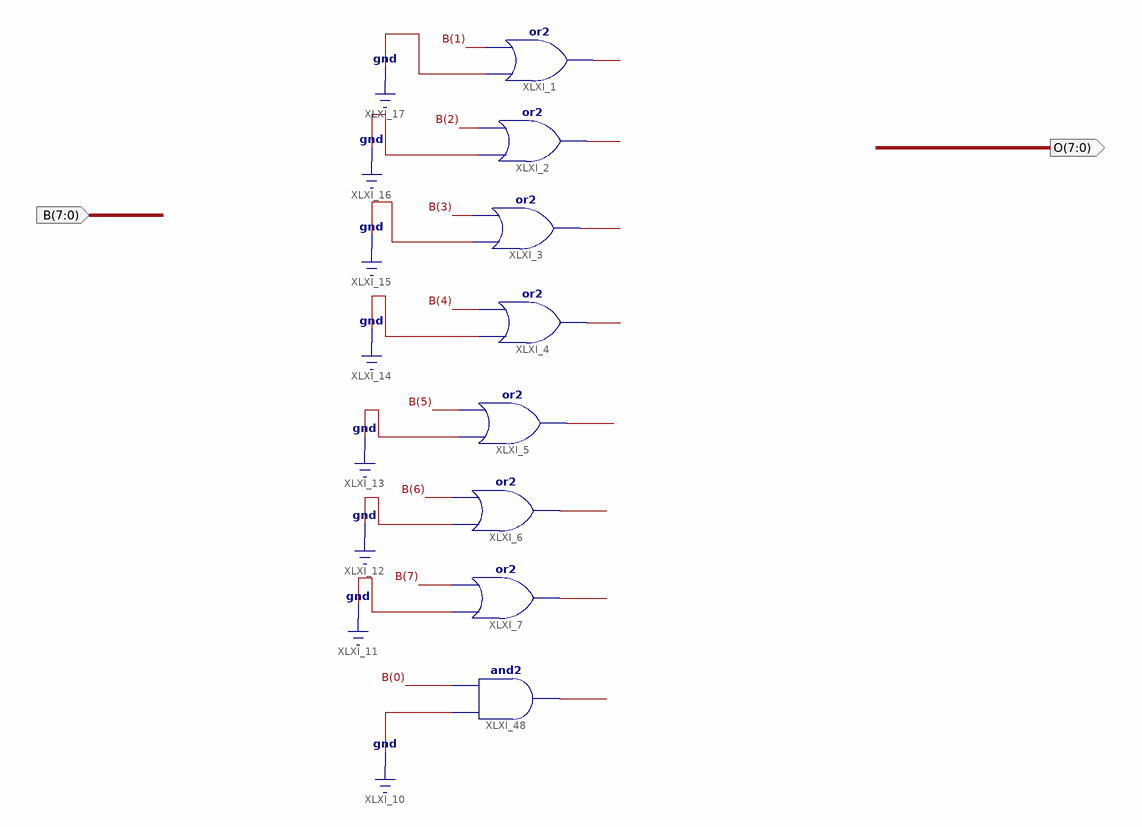
[diagram p0: schematic sheet 1]
// Xilinx ISE schematic EightBitLogicSft.sch (spartan6) as structural Verilog: 8 symbols, 2 ports
module EightBitLogicSft (
  input  [7:0] B,
  output [7:0] O
);

  or XLXI_1 (O[0], 1'b0, B[1]);
  or XLXI_2 (O[1], 1'b0, B[2]);
  or XLXI_3 (O[2], 1'b0, B[3]);
  or XLXI_4 (O[3], 1'b0, B[4]);
  or XLXI_5 (O[4], 1'b0, B[5]);
  or XLXI_6 (O[5], 1'b0, B[6]);
  or XLXI_7 (O[6], 1'b0, B[7]);
  and XLXI_48 (O[7], 1'b0, B[0]);
endmodule
